# Altium schematic sheet nexusqfp.SchDoc
size A1
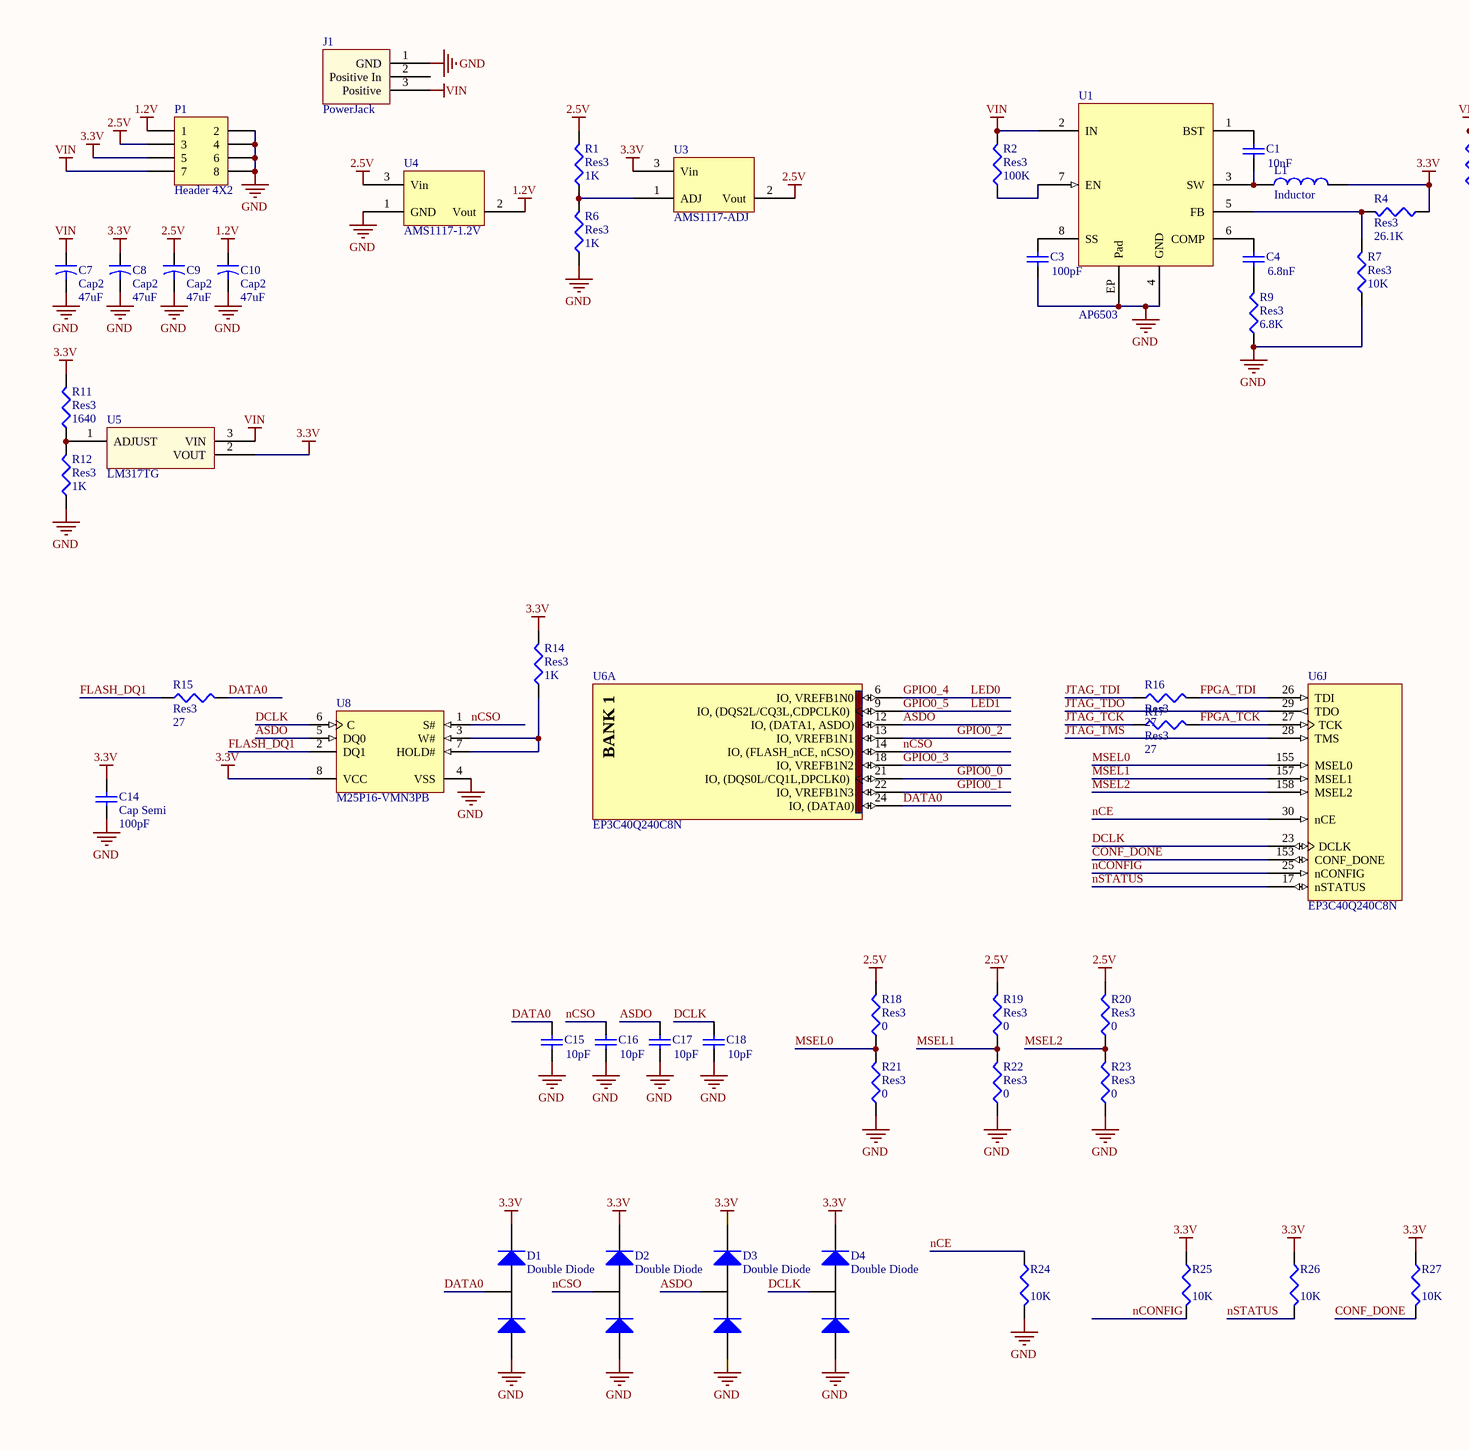
[diagram p0: nexusqfp.SchDoc, top left]
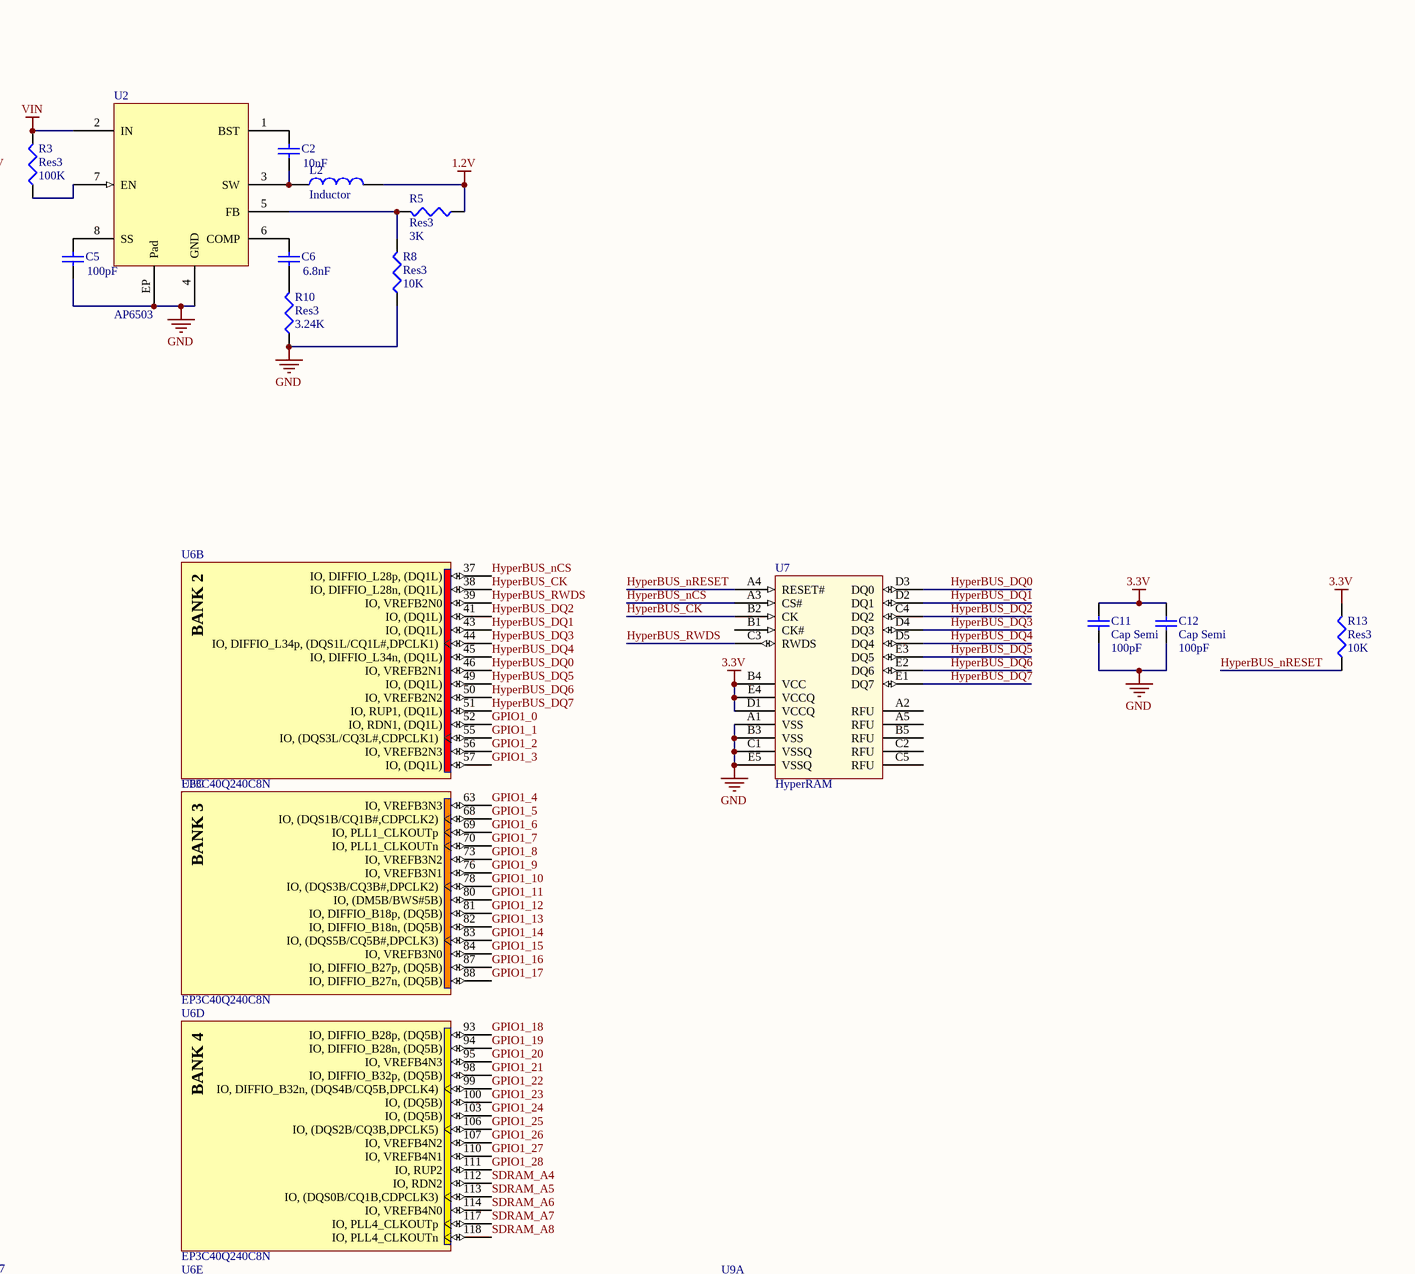
[diagram p1: nexusqfp.SchDoc, top middle]
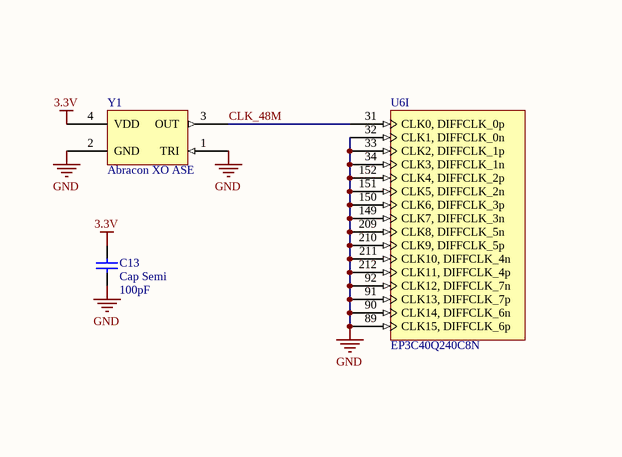
[diagram p2: nexusqfp.SchDoc, top right]
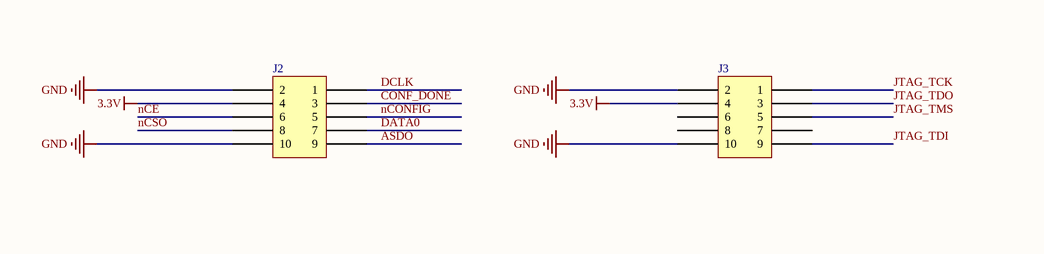
[diagram p3: nexusqfp.SchDoc, bottom left]
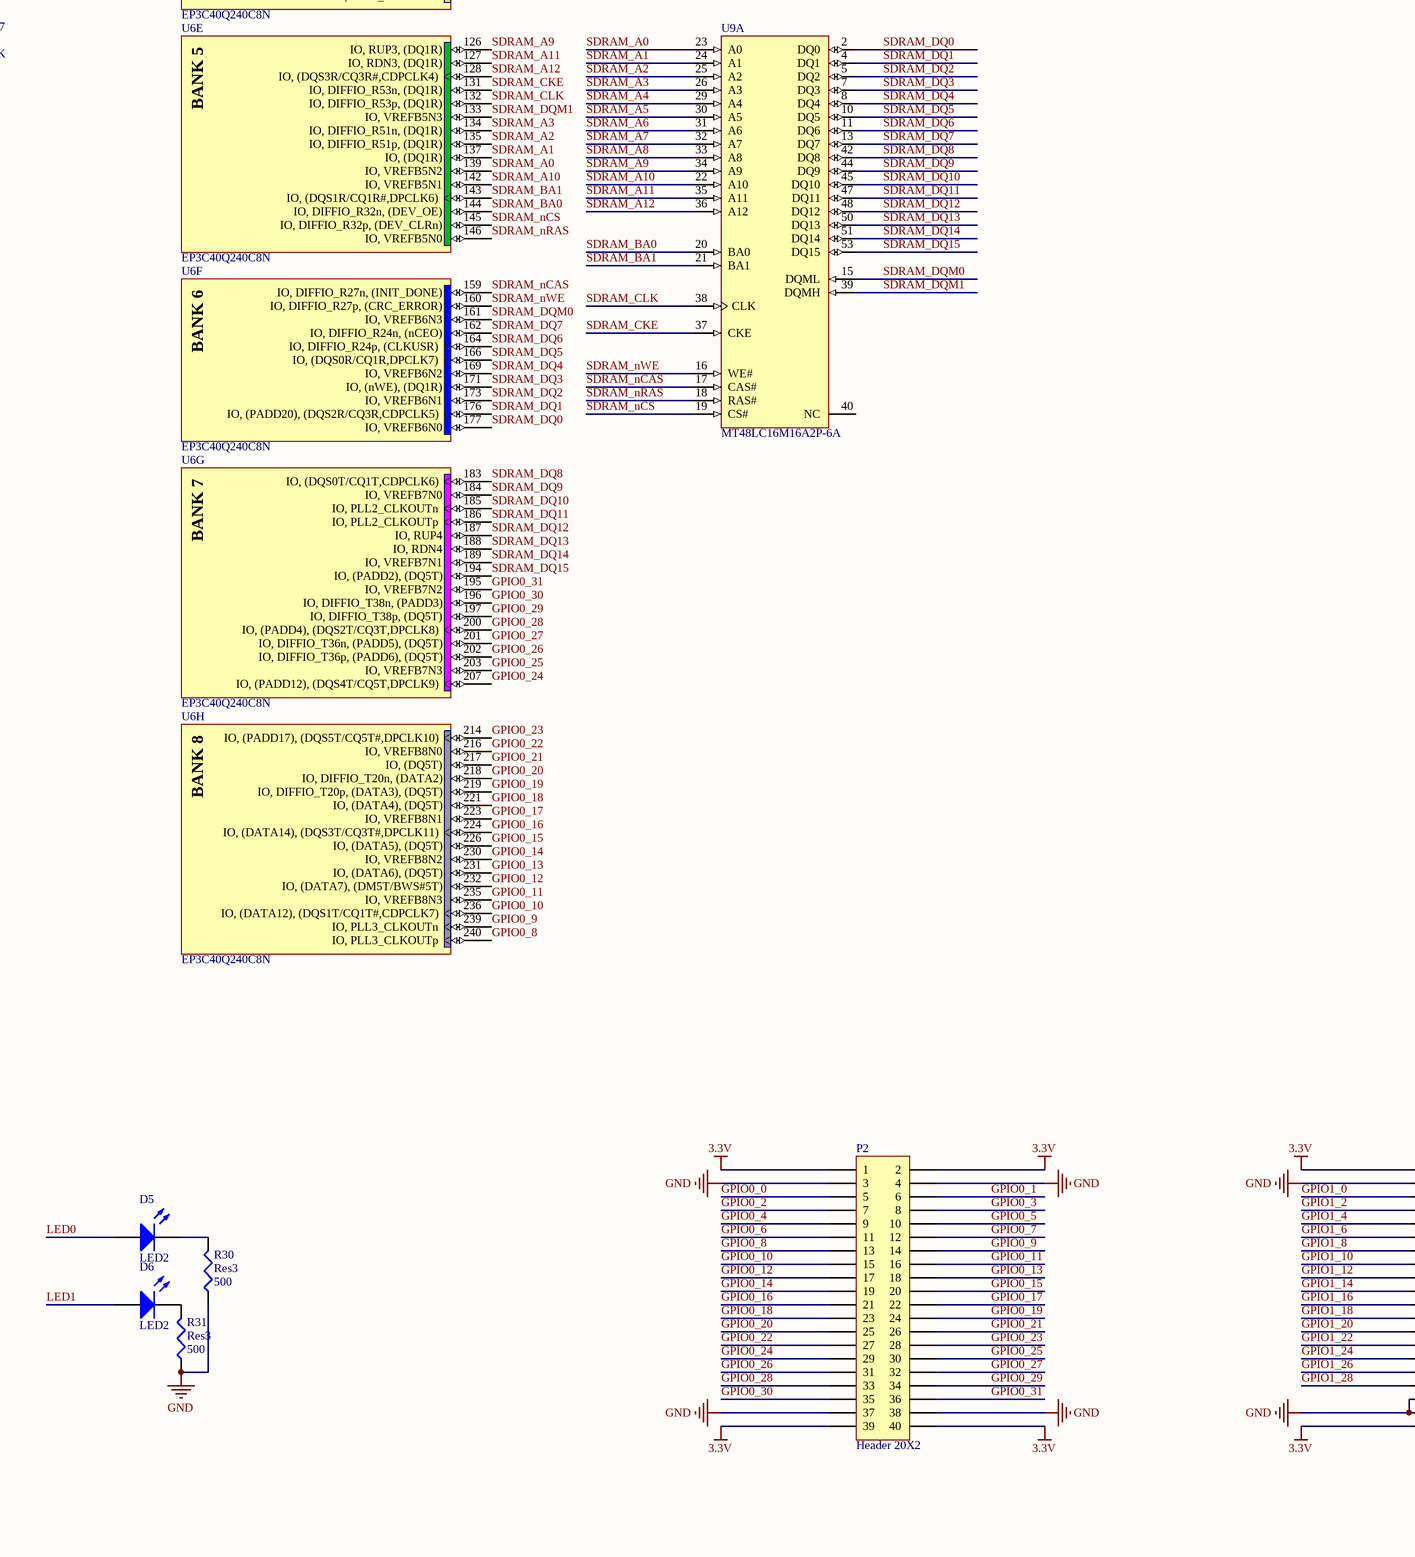
[diagram p4: nexusqfp.SchDoc, bottom middle]
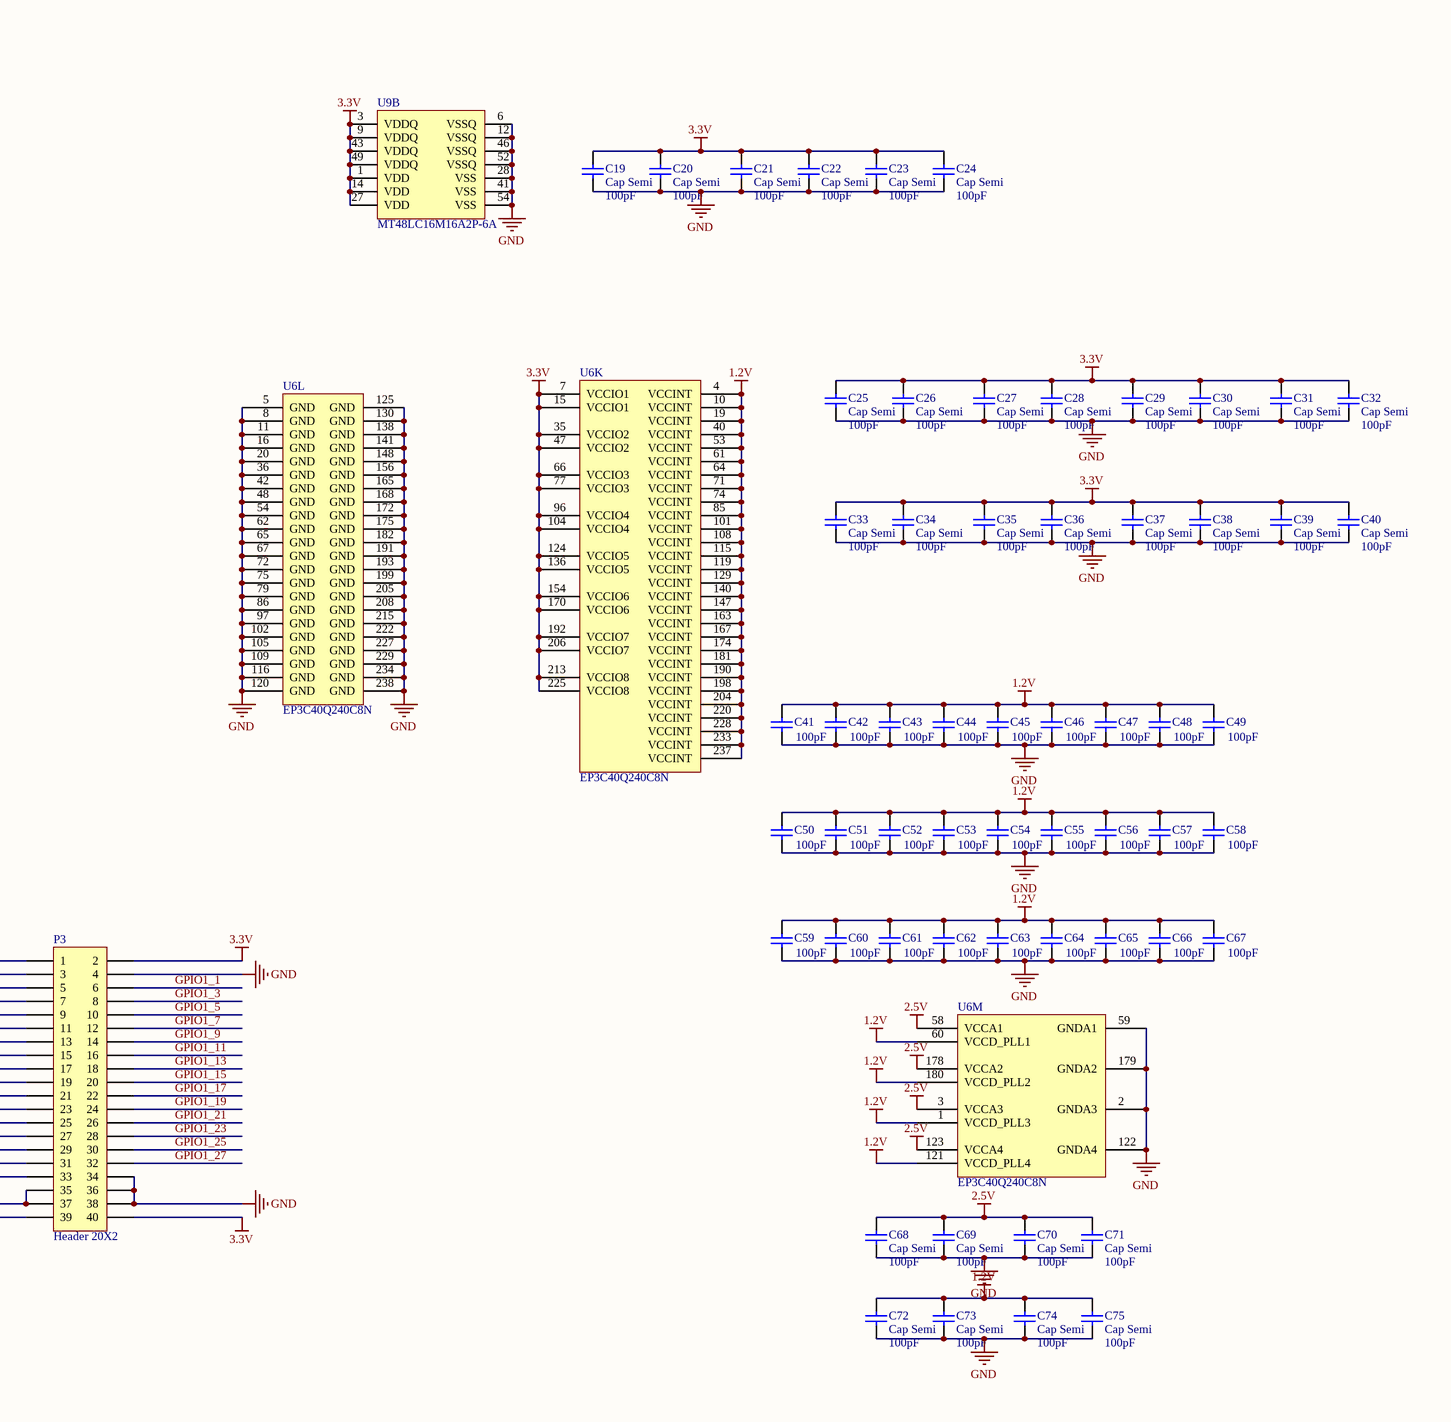
[diagram p5: nexusqfp.SchDoc, bottom right]

## Parts
C1  value 10nF  [1608[0603]]  (hidden comment: Cap Semi)
C2  value 10nF  [1608[0603]]  (hidden comment: Cap Semi)
C3  value 100pF  [1608[0603]]  (hidden comment: Cap Semi)
C4  value 6.8nF  [1608[0603]]  (hidden comment: Cap Semi)
C5  value 100pF  [1608[0603]]  (hidden comment: Cap Semi)
C6  value 6.8nF  [1608[0603]]  (hidden comment: Cap Semi)
C7  Cap2  value 47uF  [CAPR5-4X5]
C8  Cap2  value 47uF  [CAPR5-4X5]
C9  Cap2  value 47uF  [CAPR5-4X5]
C10  Cap2  value 47uF  [CAPR5-4X5]
C11  Cap Semi  value 100pF  [1608[0603]]
C12  Cap Semi  value 100pF  [1608[0603]]
C13  Cap Semi  value 100pF  [1608[0603]]
C14  Cap Semi  value 100pF  [1608[0603]]
C15  value 10pF  [1608[0603]]
C16  value 10pF  [1608[0603]]
C17  value 10pF  [1608[0603]]
C18  value 10pF  [1608[0603]]
C19  Cap Semi  value 100pF  [1608[0603]]
C20  Cap Semi  value 100pF  [1608[0603]]
C21  Cap Semi  value 100pF  [1608[0603]]
C22  Cap Semi  value 100pF  [1608[0603]]
C23  Cap Semi  value 100pF  [1608[0603]]
C24  Cap Semi  value 100pF  [1608[0603]]
C25  Cap Semi  value 100pF  [1608[0603]]
C26  Cap Semi  value 100pF  [1608[0603]]
C27  Cap Semi  value 100pF  [1608[0603]]
C28  Cap Semi  value 100pF  [1608[0603]]
C29  Cap Semi  value 100pF  [1608[0603]]
C30  Cap Semi  value 100pF  [1608[0603]]
C31  Cap Semi  value 100pF  [1608[0603]]
C32  Cap Semi  value 100pF  [1608[0603]]
C33  Cap Semi  value 100pF  [1608[0603]]
C34  Cap Semi  value 100pF  [1608[0603]]
C35  Cap Semi  value 100pF  [1608[0603]]
C36  Cap Semi  value 100pF  [1608[0603]]
C37  Cap Semi  value 100pF  [1608[0603]]
C38  Cap Semi  value 100pF  [1608[0603]]
C39  Cap Semi  value 100pF  [1608[0603]]
C40  Cap Semi  value 100pF  [1608[0603]]
C41  value 100pF  [1608[0603]]  (hidden comment: Cap Semi)
C42  value 100pF  [1608[0603]]  (hidden comment: Cap Semi)
C43  value 100pF  [1608[0603]]  (hidden comment: Cap Semi)
C44  value 100pF  [1608[0603]]  (hidden comment: Cap Semi)
C45  value 100pF  [1608[0603]]  (hidden comment: Cap Semi)
C46  value 100pF  [1608[0603]]  (hidden comment: Cap Semi)
C47  value 100pF  [1608[0603]]  (hidden comment: Cap Semi)
C48  value 100pF  [1608[0603]]  (hidden comment: Cap Semi)
C49  value 100pF  [1608[0603]]  (hidden comment: Cap Semi)
C50  value 100pF  [1608[0603]]  (hidden comment: Cap Semi)
C51  value 100pF  [1608[0603]]  (hidden comment: Cap Semi)
C52  value 100pF  [1608[0603]]  (hidden comment: Cap Semi)
C53  value 100pF  [1608[0603]]  (hidden comment: Cap Semi)
C54  value 100pF  [1608[0603]]  (hidden comment: Cap Semi)
C55  value 100pF  [1608[0603]]  (hidden comment: Cap Semi)
C56  value 100pF  [1608[0603]]  (hidden comment: Cap Semi)
C57  value 100pF  [1608[0603]]  (hidden comment: Cap Semi)
C58  value 100pF  [1608[0603]]  (hidden comment: Cap Semi)
C59  value 100pF  [1608[0603]]  (hidden comment: Cap Semi)
C60  value 100pF  [1608[0603]]  (hidden comment: Cap Semi)
C61  value 100pF  [1608[0603]]  (hidden comment: Cap Semi)
C62  value 100pF  [1608[0603]]  (hidden comment: Cap Semi)
C63  value 100pF  [1608[0603]]  (hidden comment: Cap Semi)
C64  value 100pF  [1608[0603]]  (hidden comment: Cap Semi)
C65  value 100pF  [1608[0603]]  (hidden comment: Cap Semi)
C66  value 100pF  [1608[0603]]  (hidden comment: Cap Semi)
C67  value 100pF  [1608[0603]]  (hidden comment: Cap Semi)
C68  Cap Semi  value 100pF  [1608[0603]]
C69  Cap Semi  value 100pF  [1608[0603]]
C70  Cap Semi  value 100pF  [1608[0603]]
C71  Cap Semi  value 100pF  [1608[0603]]
C72  Cap Semi  value 100pF  [1608[0603]]
C73  Cap Semi  value 100pF  [1608[0603]]
C74  Cap Semi  value 100pF  [1608[0603]]
C75  Cap Semi  value 100pF  [1608[0603]]
D1  Double Diode  [SOT-23]
D2  Double Diode  [SOT-23]
D3  Double Diode  [SOT-23]
D4  Double Diode  [SOT-23]
D5  LED2  [3.2X1.6X1.1]
D6  LED2  [3.2X1.6X1.1]
J1  PowerJack  [PJ-002A]
J2  2X5 2.54mm Conn with polarity  [2X5 with polarity]  (value not drawn)
J3  2X5 2.54mm Conn with polarity  [2X5 with polarity]  (value not drawn)
L1  Inductor  [74477110 Inductor]
L2  Inductor  [744311330]
P1  Header 4X2  [HDR2X4]
P2  Header 20X2  [HDR2X20]
P3  Header 20X2  [HDR2X20]
R1  Res3  value 1K  [J1-0603]
R2  Res3  value 100K  [J1-0603]
R3  Res3  value 100K  [J1-0603]
R4  Res3  value 26.1K  [J1-0603]
R5  Res3  value 3K  [J1-0603]
R6  Res3  value 1K  [J1-0603]
R7  Res3  value 10K  [J1-0603]
R8  Res3  value 10K  [J1-0603]
R9  Res3  value 6.8K  [J1-0603]
R10  Res3  value 3.24K  [J1-0603]
R11  Res3  value 1640  [J1-0603]
R12  Res3  value 1K  [J1-0603]
R13  Res3  value 10K  [J1-0603]
R14  Res3  value 1K  [J1-0603]
R15  Res3  value 27  [J1-0603]
R16  Res3  value 27  [J1-0603]
R17  Res3  value 27  [J1-0603]
R18  Res3  value 0  [J1-0603]
R19  Res3  value 0  [J1-0603]
R20  Res3  value 0  [J1-0603]
R21  Res3  value 0  [J1-0603]
R22  Res3  value 0  [J1-0603]
R23  Res3  value 0  [J1-0603]
R24  value 10K  [J1-0603]  (hidden comment: Res3)
R25  value 10K  [J1-0603]  (hidden comment: Res3)
R26  value 10K  [J1-0603]  (hidden comment: Res3)
R27  value 10K  [J1-0603]  (hidden comment: Res3)
R30  Res3  value 500  [J1-0603]
R31  Res3  value 500  [J1-0603]
U1  AP6503  [SO-8EP]
U2  AP6503  [SO-8EP]
U3  AMS1117-ADJ  [SOT-223]
U4  AMS1117-1.2V  [SOT-223]
U5  LM317TG  [TO-220AB]
U6  EP3C40Q240C8N  [PQFP240_N]  (parts A,B,C,D,E,F,G,H,I,J,K,L,M of 13)
U7  HyperRAM  [BGA5x5 1mm]
U8  M25P16-VMN3PB  [MICT-MN-8_N]
U9  MT48LC16M16A2P-6A  [MICT-P-54_N]  (parts A,B of 2)
Y1  Abracon XO ASE  [ABRACON ASE]

## Nets
1.2V: C10.1 C41.2 C42.2 C43.2 C44.2 C45.2 C46.2 C47.2 C48.2 C49.2 C50.2 C51.2 C52.2 C53.2 C54.2 C55.2 C56.2 C57.2 C58.2 C59.2 C60.2 C61.2 C62.2 C63.2 C64.2 C65.2 C66.2 C67.2 C72.2 C73.2 C74.2 C75.2 L2.2 P1.1 R5.1 U4.2(Vout) U6.1(VCCD_PLL3) U6.4(VCCINT) U6.10(VCCINT) U6.19(VCCINT) U6.40(VCCINT) U6.53(VCCINT) U6.60(VCCD_PLL1) U6.61(VCCINT) U6.64(VCCINT) U6.71(VCCINT) U6.74(VCCINT) U6.85(VCCINT) U6.101(VCCINT) U6.108(VCCINT) U6.115(VCCINT) U6.119(VCCINT) U6.121(VCCD_PLL4) U6.129(VCCINT) U6.140(VCCINT) U6.147(VCCINT) U6.163(VCCINT) U6.167(VCCINT) U6.174(VCCINT) U6.180(VCCD_PLL2) U6.181(VCCINT) U6.190(VCCINT) U6.198(VCCINT) U6.204(VCCINT) U6.220(VCCINT) U6.228(VCCINT) U6.233(VCCINT) U6.237(VCCINT)
2.5V: C9.1 C68.2 C69.2 C70.2 C71.2 P1.3 R1.2 R18.2 R19.2 R20.2 U3.2(Vout) U4.3(Vin) U6.3(VCCA3) U6.58(VCCA1) U6.123(VCCA4) U6.178(VCCA2)
3.3V: C8.1 C11.2 C12.2 C13.2 C14.2 C19.2 C20.2 C21.2 C22.2 C23.2 C24.2 C25.2 C26.2 C27.2 C28.2 C29.2 C30.2 C31.2 C32.2 C33.2 C34.2 C35.2 C36.2 C37.2 C38.2 C39.2 C40.2 D1.2 D2.2 D3.2 D4.2 J2.4 J3.4 L1.2 P1.5 P2.1 P2.2 P2.39 P2.40 P3.1 P3.2 P3.39 P3.40 R4.1 R11.2 R13.2 R14.2 R25.1 R26.1 R27.1 U3.3(Vin) U5.2(VOUT) U6.7(VCCIO1) U6.15(VCCIO1) U6.35(VCCIO2) U6.47(VCCIO2) U6.66(VCCIO3) U6.77(VCCIO3) U6.96(VCCIO4) U6.104(VCCIO4) U6.124(VCCIO5) U6.136(VCCIO5) U6.154(VCCIO6) U6.170(VCCIO6) U6.192(VCCIO7) U6.206(VCCIO7) U6.213(VCCIO8) U6.225(VCCIO8) U7.B4(VCC) U7.D1(VCCQ) U7.E4(VCCQ) U8.8(VCC) U9.1(VDD) U9.3(VDDQ) U9.9(VDDQ) U9.14(VDD) U9.27(VDD) U9.43(VDDQ) U9.49(VDDQ) Y1.4(VDD)
GND: C3.1 C5.1 C7.2 C8.2 C9.2 C10.2 C11.1 C12.1 C13.1 C14.1 C15.2 C16.2 C17.2 C18.2 C19.1 C20.1 C21.1 C22.1 C23.1 C24.1 C25.1 C26.1 C27.1 C28.1 C29.1 C30.1 C31.1 C32.1 C33.1 C34.1 C35.1 C36.1 C37.1 C38.1 C39.1 C40.1 C41.1 C42.1 C43.1 C44.1 C45.1 C46.1 C47.1 C48.1 C49.1 C50.1 C51.1 C52.1 C53.1 C54.1 C55.1 C56.1 C57.1 C58.1 C59.1 C60.1 C61.1 C62.1 C63.1 C64.1 C65.1 C66.1 C67.1 C68.1 C69.1 C70.1 C71.1 C72.1 C73.1 C74.1 C75.1 D1.1 D2.1 D3.1 D4.1 J1.1(GND) J2.2 J2.10 J3.2 J3.10 P1.2 P1.4 P1.6 P1.8 P2.3 P2.4 P2.37 P2.38 P3.3 P3.4 P3.34 P3.35 P3.36 P3.37 P3.38 R6.1 R7.1 R8.1 R9.1 R10.1 R12.1 R21.1 R22.1 R23.1 R24.2 R30.1 R31.1 U1.4(GND) U1.EP(Pad) U2.4(GND) U2.EP(Pad) U4.1(GND) U6.2(GNDA3) U6.5(GND) U6.8(GND) U6.11(GND) U6.16(GND) U6.20(GND) U6.32(CLK1,_DIFFCLK_0n) U6.33(CLK2,_DIFFCLK_1p) U6.34(CLK3,_DIFFCLK_1n) U6.36(GND) U6.42(GND) U6.48(GND) U6.54(GND) U6.59(GNDA1) U6.62(GND) U6.65(GND) U6.67(GND) U6.72(GND) U6.75(GND) U6.79(GND) U6.86(GND) U6.89(CLK15,_DIFFCLK_6p) U6.90(CLK14,_DIFFCLK_6n) U6.91(CLK13,_DIFFCLK_7p) U6.92(CLK12,_DIFFCLK_7n) U6.97(GND) U6.102(GND) U6.105(GND) U6.109(GND) U6.116(GND) U6.120(GND) U6.122(GNDA4) U6.125(GND) U6.130(GND) U6.138(GND) U6.141(GND) U6.148(GND) U6.149(CLK7,_DIFFCLK_3n) U6.150(CLK6,_DIFFCLK_3p) U6.151(CLK5,_DIFFCLK_2n) U6.152(CLK4,_DIFFCLK_2p) U6.156(GND) U6.165(GND) U6.168(GND) U6.172(GND) U6.175(GND) U6.179(GNDA2) U6.182(GND) U6.191(GND) U6.193(GND) U6.199(GND) U6.205(GND) U6.208(GND) U6.209(CLK8,_DIFFCLK_5n) U6.210(CLK9,_DIFFCLK_5p) U6.211(CLK10,_DIFFCLK_4n) U6.212(CLK11,_DIFFCLK_4p) U6.215(GND) U6.222(GND) U6.227(GND) U6.229(GND) U6.234(GND) U6.238(GND) U7.A1(VSS) U7.B3(VSS) U7.C1(VSSQ) U7.E5(VSSQ) U8.4(VSS) U9.6(VSSQ) U9.12(VSSQ) U9.28(VSS) U9.41(VSS) U9.46(VSSQ) U9.52(VSSQ) U9.54(VSS) Y1.1(TRI) Y1.2(GND)
VIN: C7.1 J1.3(Positive) P1.7 R2.2 R3.2 U1.2(IN) U2.2(IN) U5.3(VIN)
ASDO: C17.1 D3.3 J2.9 U6.12(IO,_(DATA1,_ASDO)) U8.5(DQ0)
CLK_48M: U6.31(CLK0,_DIFFCLK_0p) Y1.3(OUT)
CONF_DONE: J2.3 R27.2 U6.153(CONF_DONE)
DATA0: C15.1 D1.3 J2.7 R15.2 U6.24(IO,_(DATA0))
DCLK: C18.1 D4.3 J2.1 U6.23(DCLK) U8.6(C)
FLASH_DQ1: R15.1 U8.2(DQ1)
FPGA_TCK: R17.2 U6.27(TCK)
FPGA_TDI: R16.2 U6.26(TDI)
GPIO0_0: P2.5 U6.21(IO,_(DQS0L/CQ1L,DPCLK0))
GPIO0_1: P2.6 U6.22(IO,_VREFB1N3)
GPIO0_2: P2.7 U6.13(IO,_VREFB1N1)
GPIO0_3: P2.8 U6.18(IO,_VREFB1N2)
GPIO0_4: D5.1(A) P2.9 U6.6(IO,_VREFB1N0)  [also labelled LED0]
GPIO0_5: D6.1(A) P2.10 U6.9(IO,_(DQS2L/CQ3L,CDPCLK0))  [also labelled LED1]
GPIO0_6: P2.11
GPIO0_7: P2.12
GPIO0_8: P2.13 U6.240(IO,_PLL3_CLKOUTp)
GPIO0_9: P2.14 U6.239(IO,_PLL3_CLKOUTn)
GPIO0_10: P2.15 U6.236(IO,_(DATA12),_(DQS1T/CQ1T#,CDPCLK7))
GPIO0_11: P2.16 U6.235(IO,_VREFB8N3)
GPIO0_12: P2.17 U6.232(IO,_(DATA7),_(DM5T/BWS#5T))
GPIO0_13: P2.18 U6.231(IO,_(DATA6),_(DQ5T))
GPIO0_14: P2.19 U6.230(IO,_VREFB8N2)
GPIO0_15: P2.20 U6.226(IO,_(DATA5),_(DQ5T))
GPIO0_16: P2.21 U6.224(IO,_(DATA14),_(DQS3T/CQ3T#,DPCLK11))
GPIO0_17: P2.22 U6.223(IO,_VREFB8N1)
GPIO0_18: P2.23 U6.221(IO,_(DATA4),_(DQ5T))
GPIO0_19: P2.24 U6.219(IO,_DIFFIO_T20p,_(DATA3),_(DQ5T))
GPIO0_20: P2.25 U6.218(IO,_DIFFIO_T20n,_(DATA2))
GPIO0_21: P2.26 U6.217(IO,_(DQ5T))
GPIO0_22: P2.27 U6.216(IO,_VREFB8N0)
GPIO0_23: P2.28 U6.214(IO,_(PADD17),_(DQS5T/CQ5T#,DPCLK10))
GPIO0_24: P2.29 U6.207(IO,_(PADD12),_(DQS4T/CQ5T,DPCLK9))
GPIO0_25: P2.30 U6.203(IO,_VREFB7N3)
GPIO0_26: P2.31 U6.202(IO,_DIFFIO_T36p,_(PADD6),_(DQ5T))
GPIO0_27: P2.32 U6.201(IO,_DIFFIO_T36n,_(PADD5),_(DQ5T))
GPIO0_28: P2.33 U6.200(IO,_(PADD4),_(DQS2T/CQ3T,DPCLK8))
GPIO0_29: P2.34 U6.197(IO,_DIFFIO_T38p,_(DQ5T))
GPIO0_30: P2.35 U6.196(IO,_DIFFIO_T38n,_(PADD3))
GPIO0_31: P2.36 U6.195(IO,_VREFB7N2)
GPIO1_0: P3.5 U6.52(IO,_RDN1,_(DQ1L))
GPIO1_1: P3.6 U6.55(IO,_(DQS3L/CQ3L#,CDPCLK1))
GPIO1_2: P3.7 U6.56(IO,_VREFB2N3)
GPIO1_3: P3.8 U6.57(IO,_(DQ1L))
GPIO1_4: P3.9 U6.63(IO,_VREFB3N3)
GPIO1_5: P3.10 U6.68(IO,_(DQS1B/CQ1B#,CDPCLK2))
GPIO1_6: P3.11 U6.69(IO,_PLL1_CLKOUTp)
GPIO1_7: P3.12 U6.70(IO,_PLL1_CLKOUTn)
GPIO1_8: P3.13 U6.73(IO,_VREFB3N2)
GPIO1_9: P3.14 U6.76(IO,_VREFB3N1)
GPIO1_10: P3.15 U6.78(IO,_(DQS3B/CQ3B#,DPCLK2))
GPIO1_11: P3.16 U6.80(IO,_(DM5B/BWS#5B))
GPIO1_12: P3.17 U6.81(IO,_DIFFIO_B18p,_(DQ5B))
GPIO1_13: P3.18 U6.82(IO,_DIFFIO_B18n,_(DQ5B))
GPIO1_14: P3.19 U6.83(IO,_(DQS5B/CQ5B#,DPCLK3))
GPIO1_15: P3.20 U6.84(IO,_VREFB3N0)
GPIO1_16: P3.21 U6.87(IO,_DIFFIO_B27p,_(DQ5B))
GPIO1_17: P3.22 U6.88(IO,_DIFFIO_B27n,_(DQ5B))
GPIO1_18: P3.23 U6.93(IO,_DIFFIO_B28p,_(DQ5B))
GPIO1_19: P3.24 U6.94(IO,_DIFFIO_B28n,_(DQ5B))
GPIO1_20: P3.25 U6.95(IO,_VREFB4N3)
GPIO1_21: P3.26 U6.98(IO,_DIFFIO_B32p,_(DQ5B))
GPIO1_22: P3.27 U6.99(IO,_DIFFIO_B32n,_(DQS4B/CQ5B,DPCLK4))
GPIO1_23: P3.28 U6.100(IO,_(DQ5B))
GPIO1_24: P3.29 U6.103(IO,_(DQ5B))
GPIO1_25: P3.30 U6.106(IO,_(DQS2B/CQ3B,DPCLK5))
GPIO1_26: P3.31 U6.107(IO,_VREFB4N2)
GPIO1_27: P3.32 U6.110(IO,_VREFB4N1)
GPIO1_28: P3.33 U6.111(IO,_RUP2)
HyperBUS_CK: U6.38(IO,_DIFFIO_L28n,_(DQ1L)) U7.B2(CK)
HyperBUS_DQ0: U6.46(IO,_VREFB2N1) U7.D3(DQ0)
HyperBUS_DQ1: U6.43(IO,_(DQ1L)) U7.D2(DQ1)
HyperBUS_DQ2: U6.41(IO,_(DQ1L)) U7.C4(DQ2)
HyperBUS_DQ3: U6.44(IO,_DIFFIO_L34p,_(DQS1L/CQ1L#,DPCLK1)) U7.D4(DQ3)
HyperBUS_DQ4: U6.45(IO,_DIFFIO_L34n,_(DQ1L)) U7.D5(DQ4)
HyperBUS_DQ5: U6.49(IO,_(DQ1L)) U7.E3(DQ5)
HyperBUS_DQ6: U6.50(IO,_VREFB2N2) U7.E2(DQ6)
HyperBUS_DQ7: U6.51(IO,_RUP1,_(DQ1L)) U7.E1(DQ7)
HyperBUS_nCS: U6.37(IO,_DIFFIO_L28p,_(DQ1L)) U7.A3(CS#)
HyperBUS_nRESET: R13.1 U7.A4(RESET#)
HyperBUS_RWDS: U6.39(IO,_VREFB2N0) U7.C3(RWDS)
JTAG_TCK: J3.1 R17.1
JTAG_TDI: J3.9 R16.1
JTAG_TDO: J3.3 U6.29(TDO)
JTAG_TMS: J3.5 U6.28(TMS)
MSEL0: R18.1 R21.2 U6.155(MSEL0)
MSEL1: R19.1 R22.2 U6.157(MSEL1)
MSEL2: R20.1 R23.2 U6.158(MSEL2)
nCE: J2.6 R24.1 U6.30(nCE)
nCONFIG: J2.5 R25.2 U6.25(nCONFIG)
nCSO: C16.1 D2.3 J2.8 U6.14(IO,_(FLASH_nCE,_nCSO)) U8.1(S#)
nSTATUS: R26.2 U6.17(nSTATUS)
SDRAM_A0: U6.139(IO,_VREFB5N2) U9.23(A0)
SDRAM_A1: U6.137(IO,_(DQ1R)) U9.24(A1)
SDRAM_A2: U6.135(IO,_DIFFIO_R51p,_(DQ1R)) U9.25(A2)
SDRAM_A3: U6.134(IO,_DIFFIO_R51n,_(DQ1R)) U9.26(A3)
SDRAM_A4: U6.112(IO,_RDN2) U9.29(A4)
SDRAM_A5: U6.113(IO,_(DQS0B/CQ1B,CDPCLK3)) U9.30(A5)
SDRAM_A6: U6.114(IO,_VREFB4N0) U9.31(A6)
SDRAM_A7: U6.117(IO,_PLL4_CLKOUTp) U9.32(A7)
SDRAM_A8: U6.118(IO,_PLL4_CLKOUTn) U9.33(A8)
SDRAM_A9: U6.126(IO,_RUP3,_(DQ1R)) U9.34(A9)
SDRAM_A10: U6.142(IO,_VREFB5N1) U9.22(A10)
SDRAM_A11: U6.127(IO,_RDN3,_(DQ1R)) U9.35(A11)
SDRAM_A12: U6.128(IO,_(DQS3R/CQ3R#,CDPCLK4)) U9.36(A12)
SDRAM_BA0: U6.144(IO,_DIFFIO_R32n,_(DEV_OE)) U9.20(BA0)
SDRAM_BA1: U6.143(IO,_(DQS1R/CQ1R#,DPCLK6)) U9.21(BA1)
SDRAM_CKE: U6.131(IO,_DIFFIO_R53n,_(DQ1R)) U9.37(CKE)
SDRAM_CLK: U6.132(IO,_DIFFIO_R53p,_(DQ1R)) U9.38(CLK)
SDRAM_DQ0: U6.177(IO,_VREFB6N0) U9.2(DQ0)
SDRAM_DQ1: U6.176(IO,_(PADD20),_(DQS2R/CQ3R,CDPCLK5)) U9.4(DQ1)
SDRAM_DQ2: U6.173(IO,_VREFB6N1) U9.5(DQ2)
SDRAM_DQ3: U6.171(IO,_(nWE),_(DQ1R)) U9.7(DQ3)
SDRAM_DQ4: U6.169(IO,_VREFB6N2) U9.8(DQ4)
SDRAM_DQ5: U6.166(IO,_(DQS0R/CQ1R,DPCLK7)) U9.10(DQ5)
SDRAM_DQ6: U6.164(IO,_DIFFIO_R24p,_(CLKUSR)) U9.11(DQ6)
SDRAM_DQ7: U6.162(IO,_DIFFIO_R24n,_(nCEO)) U9.13(DQ7)
SDRAM_DQ8: U6.183(IO,_(DQS0T/CQ1T,CDPCLK6)) U9.42(DQ8)
SDRAM_DQ9: U6.184(IO,_VREFB7N0) U9.44(DQ9)
SDRAM_DQ10: U6.185(IO,_PLL2_CLKOUTn) U9.45(DQ10)
SDRAM_DQ11: U6.186(IO,_PLL2_CLKOUTp) U9.47(DQ11)
SDRAM_DQ12: U6.187(IO,_RUP4) U9.48(DQ12)
SDRAM_DQ13: U6.188(IO,_RDN4) U9.50(DQ13)
SDRAM_DQ14: U6.189(IO,_VREFB7N1) U9.51(DQ14)
SDRAM_DQ15: U6.194(IO,_(PADD2),_(DQ5T)) U9.53(DQ15)
SDRAM_DQM0: U6.161(IO,_VREFB6N3) U9.15(DQML)
SDRAM_DQM1: U6.133(IO,_VREFB5N3) U9.39(DQMH)
SDRAM_nCAS: U6.159(IO,_DIFFIO_R27n,_(INIT_DONE)) U9.17(CAS#)
SDRAM_nCS: U6.145(IO,_DIFFIO_R32p,_(DEV_CLRn)) U9.19(CS#)
SDRAM_nRAS: U6.146(IO,_VREFB5N0) U9.18(RAS#)
SDRAM_nWE: U6.160(IO,_DIFFIO_R27p,_(CRC_ERROR)) U9.16(WE#)
NetC1_1: C1.1 L1.1 U1.3(SW)
NetC1_2: C1.2 U1.1(BST)
NetC2_1: C2.1 L2.1 U2.3(SW)
NetC2_2: C2.2 U2.1(BST)
NetC3_2: C3.2 U1.8(SS)
NetC4_1: C4.1 R9.2
NetC4_2: C4.2 U1.6(COMP)
NetC5_2: C5.2 U2.8(SS)
NetC6_1: C6.1 R10.2
NetC6_2: C6.2 U2.6(COMP)
NetD5_2: D5.2(K) R30.2
NetD6_2: D6.2(K) R31.2
NetR1_1: R1.1 R6.2 U3.1(ADJ)
NetR2_1: R2.1 U1.7(EN)
NetR3_1: R3.1 U2.7(EN)
NetR4_2: R4.2 R7.2 U1.5(FB)
NetR5_2: R5.2 R8.2 U2.5(FB)
NetR11_1: R11.1 R12.2 U5.1(ADJUST)
NetR14_1: R14.1 U8.3(W#) U8.7(HOLD#)

Not connected (* = marked no-connect by the designer): J1 2(Positive_In); J3 6 7 8; U7 A2(RFU) A5(RFU) B1(CK#) B5(RFU) C2(RFU) C5(RFU); U9 40(NC)

## Notes on the sheet
- (in symbol EP3C40Q240C8N, part A) BANK 1
- (in symbol EP3C40Q240C8N, part B) BANK 2
- (in symbol EP3C40Q240C8N, part C) BANK 3
- (in symbol EP3C40Q240C8N, part D) BANK 4
- (in symbol EP3C40Q240C8N, part E) BANK 5
- (in symbol EP3C40Q240C8N, part F) BANK 6
- (in symbol EP3C40Q240C8N, part G) BANK 7
- (in symbol EP3C40Q240C8N, part H) BANK 8

## Library data of the parts
C1-C6 C11-C75 = Cap Semi: Capacitor (Semiconductor SIM Model); Published: 8-Jun-2000; LatestRevisionDate: 29-May-2009; LatestRevisionNote: IPC-7351 Footprint Added.; PackageReference: C1206; Publisher: Altium Limited; PackageDescription: Chip Capacitor
C7-C10 = Cap2: Capacitor; Published: 23-Sep-2002; PackageReference: CAPR5-4X5; Publisher: Altium Limited; PackageDescription: Capacitor; 2 Leads
D1-D4 = BAT54S
D5 D6 = LED2: Typical RED, GREEN, YELLOW, AMBER GaAs LED; Published: 8-Jun-2000; LatestRevisionDate: 17-Jul-2002; LatestRevisionNote: Re-released for DXP Platform.; PackageVersion: Feb-2002; PackageReference: 3.2X1.6X1.1; Publisher: Altium Limited; PackageDescription: SM LED; 2 Flat Leads
L1 L2 = Inductor: Value: 10uH
P1 = Header 4X2: Header, 4-Pin, Dual row; LatestRevisionDate: 17-Jul-2002; LatestRevisionNote: Re-released for DXP Platform.; Publisher: Altium Limited
P2 P3 = Header 20X2: Header, 20-Pin, Dual row; LatestRevisionDate: 17-Jul-2002; LatestRevisionNote: Re-released for DXP Platform.; Publisher: Altium Limited
R1-R27 R30 R31 = Res3: Resistor; Published: 8-Jun-2000; LatestRevisionDate: 29-May-2009; LatestRevisionNote: IPC-7351 Footprint Added.; PackageReference: J1-0603; Publisher: Altium Limited; PackageDescription: Chip Resistor
U5 = LM317TG: Imported; Vendor: ON Semiconductor; Built_By: EMA_UL_Team; C: Copyright (C) 2015 Accelerated Designs. All rights reserved; Manufacturer_Part_Number: LM317TG; Value: Value; Type: Type; RefDes: RefDes
U6 = EP3C40Q240C8N: Cyclone III Family FPGA, 128 I/O Pins, 4 PLLs, 240-Pin PQFP, Speed Grade 8, Commercial Grade, Pb-Free; Published: 26-Feb-2007; DatasheetVersion: ver2.0, May-2008; PackageVersion: ver15.4, Dec-2008; PackageReference: PQFP240; Publisher: Altium Limited; PackageDescription: 240-Pin Plastic Quad Flat Pack (PQFP240) - Wire Bond; Supplier 1: Digi-Key; Supplier Part Number 1: 544-2551-ND; Supplier 2: Farnell; Supplier Part Number 2: 1635069; Code_JEDEC: MS-029-GA; ComponentLink1Description: Manufacturer Link; ComponentLink1URL: http://www.altera.com/; ComponentLink2Description: Handbook (7.86MB); ComponentLink2URL: http://www.altera.com/literature/hb/cyc3/cyclone3_handbook.pdf; ComponentLink3Description: Packaging Specification; ComponentLink3URL: http://www.altera.com/literature/ds/dspkg.pdf
U8 = M25P16-VMN3PB: 16 Mb (x1) Automotive Serial NOR Flash Memory, 75 MHz, 2.7 to 3.6 V, 8-pin SO8 Narrow (MN), Tube; Part Family: M25P; Manufacturer: Micron; Density: 16Mb; Speed: 75 MHz; Voltage: 2.7V-3.6V; DatasheetVersion: Rev. Y; PackageVersion: Rev 11; PackageReference: MICT-MN-8; PackageDescription: 8-Pin SO Narrow, 3.9 X 4.9 mm, Pitch 1.27 mm; Applications: Automotive; Package: SO8 Narrow; Part Status: Production; RoHS: Yes; Type: Data Storage; Width: x1; Mounting Technology: Surface Mount; PartNumber: M25P16-VMN3PB; ComponentLink1Description: Manufacturer URL; ComponentLink1URL: http://www.micron.com/; ComponentLink2Description: Datasheet; ComponentLink2URL: http://www.micron.com/~/media/Documents/Products/Data%20Sheet/NOR%20Flash/Serial%20NOR/M25P/M25P16.pdf; ComponentLink3Description: Package Specification; ComponentLink3URL: http://www.micron.com/~/media/Documents/Products/Data%20Sheet/NOR%20Flash/Serial%20NOR/M25P/M25P05A.pdf
U9 = MT48LC16M16A2P-6A: 256Mb PC133 SDR SDRAM, 16Mb x 16, 6ns, 3.3V, 0 to 70 degC, 54-Pin TSOP, Pb-Free; Manufacturer: Micron; CL: CL = 3; Clock Rate: 167 MHz; Op. Temp.: 0C to +70C; DatasheetVersion: Rev.Q; PackageVersion: Rev.Q; PackageReference: MICT-P-54; PackageDescription: 54-Pin Thin Small Outline Package, 10.16 x 22.22 mm, Pitch 0.8 mm; Cycle Time: 6ns; Data Rate: PC133; Density: 256Mb; Depth: 16Mb; RoHS: Yes; Voltage: 3.3V; Width: x16; Mounting Technology: Surface Mount; PartNumber: MT48LC16M16A2P-6A; ComponentLink1Description: Manufacturer URL; ComponentLink1URL: http://www.micron.com/; ComponentLink2Description: Datasheet; ComponentLink2URL: http://www.micron.com/~/media/Documents/Products/Data%20Sheet/DRAM/256Mb_sdr.pdf; ComponentLink3Description: Package Specification; ComponentLink3URL: http://www.micron.com/~/media/Documents/Products/Data%20Sheet/DRAM/128mb_x4x8x16_sdram.pdf
Y1 = Abracon XO ASE: SMD CMOS Crystal Oscillator